# EAGLE design Taschenlampe_LX V1.0 (EAGLE 7.1.0)
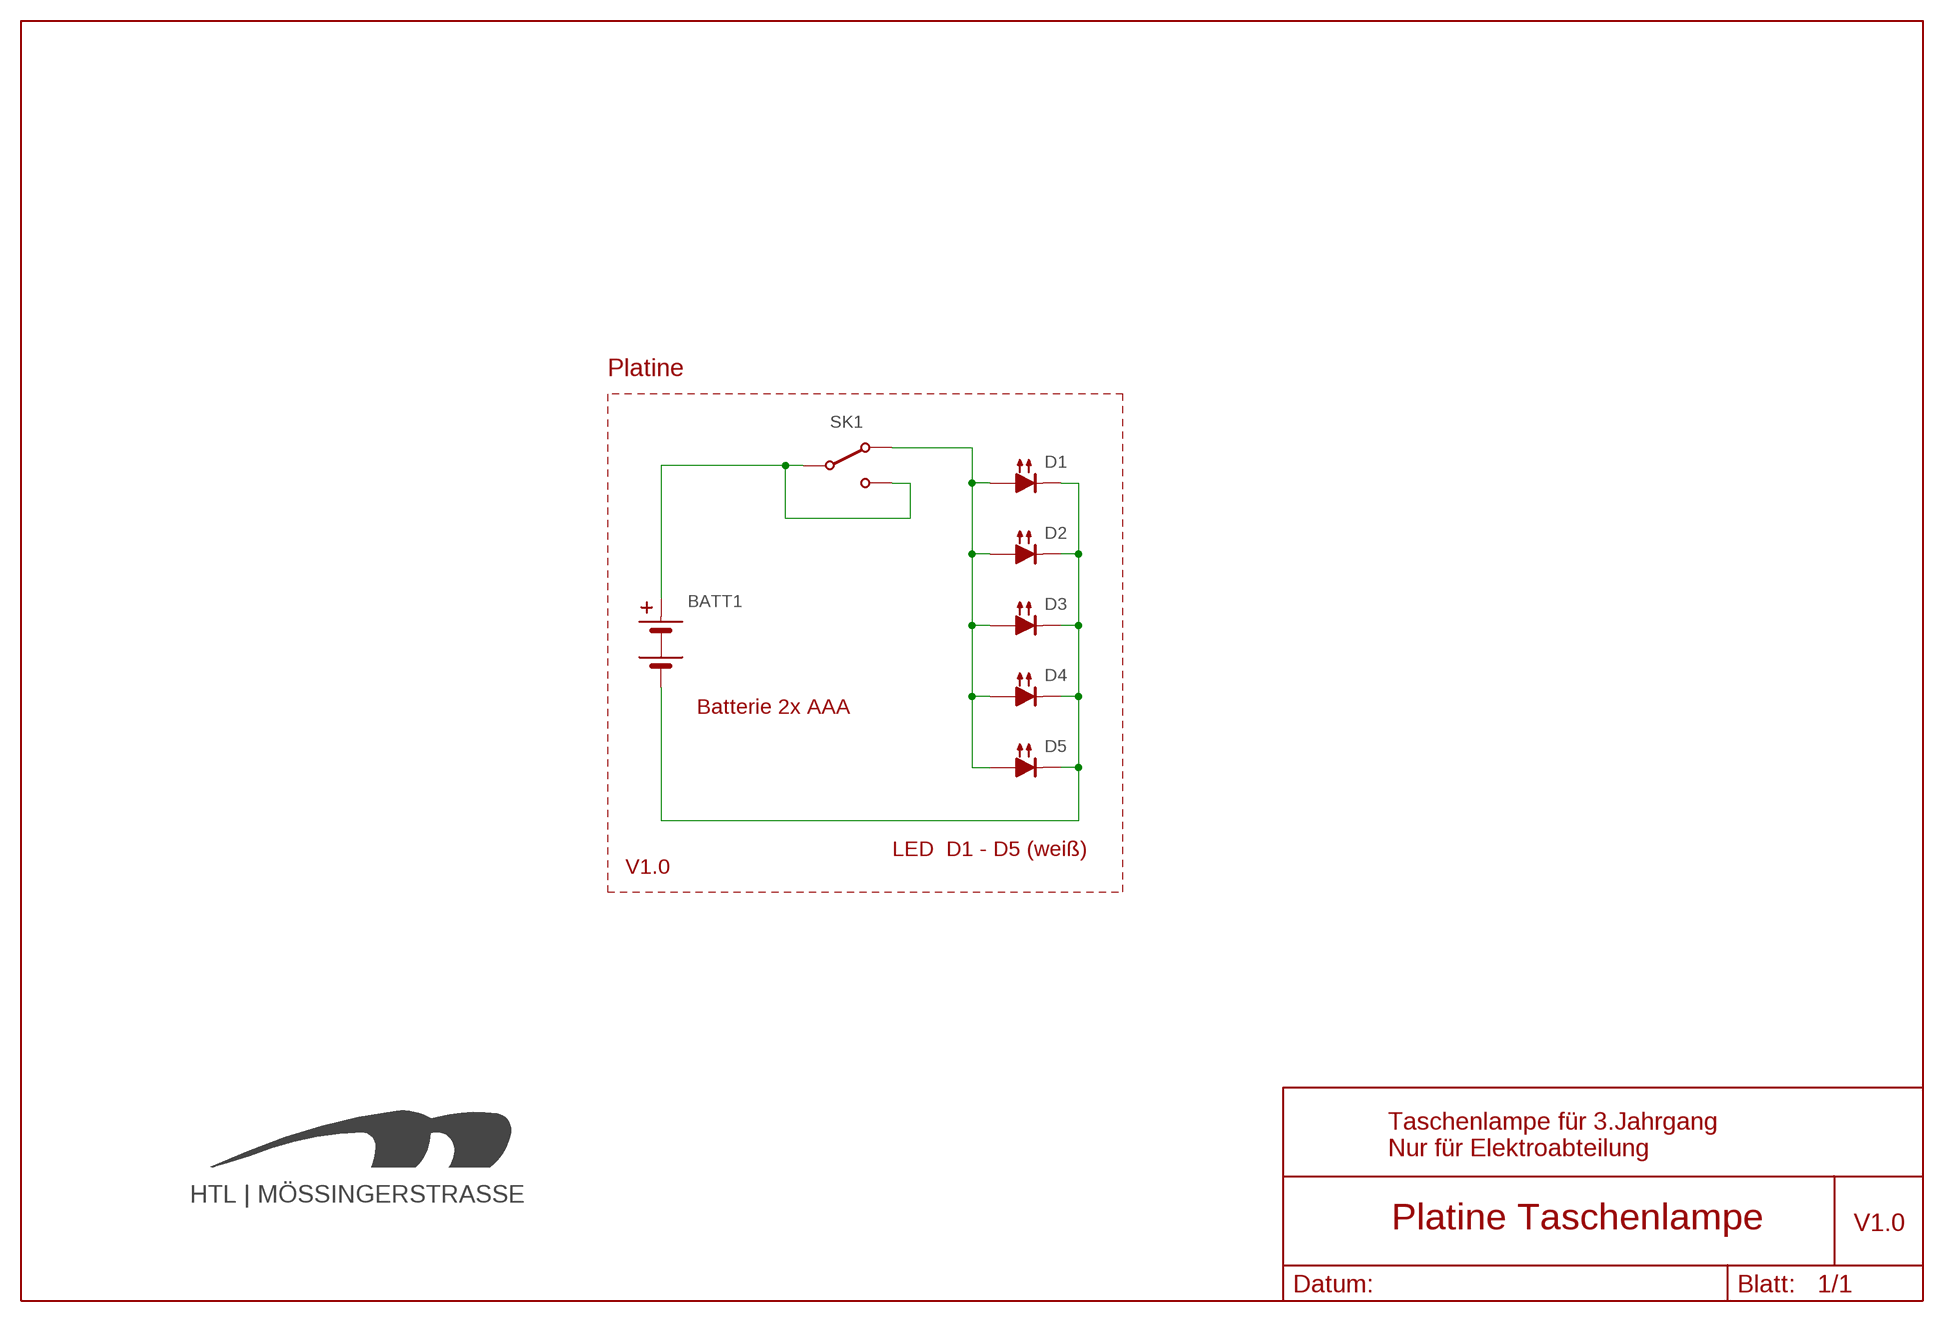
[diagram p0: schematic, sheet 1]

## Parts
BATT1  BATTERIEHALTER_2X_AAA  [BATTERIEHALTER]
D1  LEUCHTDIODE_DIN_ALT  [LEUCHTDIODE]
D2  LEUCHTDIODE_DIN_ALT  [LEUCHTDIODE]
D3  LEUCHTDIODE_DIN_ALT  [LEUCHTDIODE]
D4  LEUCHTDIODE_DIN_ALT  [LEUCHTDIODE]
D5  LEUCHTDIODE_DIN_ALT  [LEUCHTDIODE]
SK1  SCHALTER  [SCHALTER]
U$2  HTL_LOGOBOT_15MM  [LOGOBOT_15]

## Nets
N$1: BATT1.P+ SK1.P SK1.P2
N$2: D1.A D2.A D3.A D4.A D5.A SK1.P1
N$3: BATT1.P- D1.K D2.K D3.K D4.K D5.K

## Notes on the sheet
- Platine
- Batterie 2x AAA
- LED  D1 - D5 (weiß)
- V1.0
- Taschenlampe für 3.Jahrgang 
  Nur für Elektroabteilung
- Platine Taschenlampe | V1.0

## Library data of the parts
BATT1 = Taschenlampe:BATTERIEHALTER_2X_AAA: Batteriehalter 2x AAA, printbar
D1-D5 = Taschenlampe:LEUCHTDIODE_DIN_ALT: Leuchtdiode DIN-Norm (alt)
SK1 = Taschenlampe:SCHALTER: Schiebeschalter, Wechsler
U$2 = HTL-Logo:HTL_LOGO

## Board
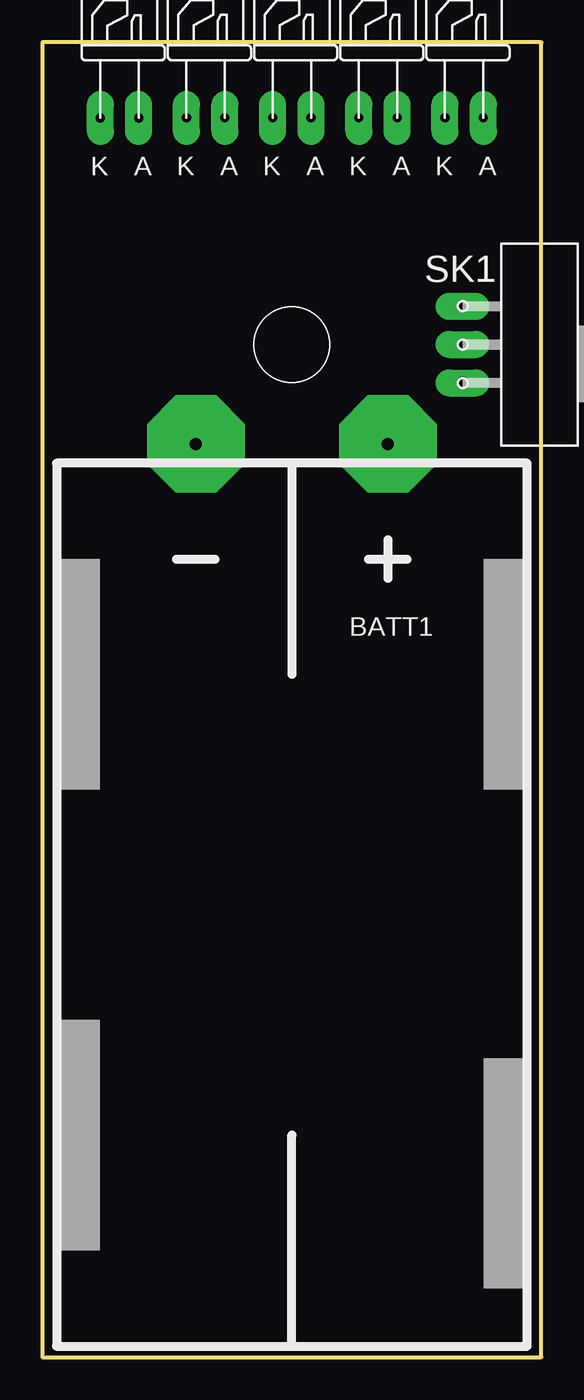
[diagram p1: board, top side]
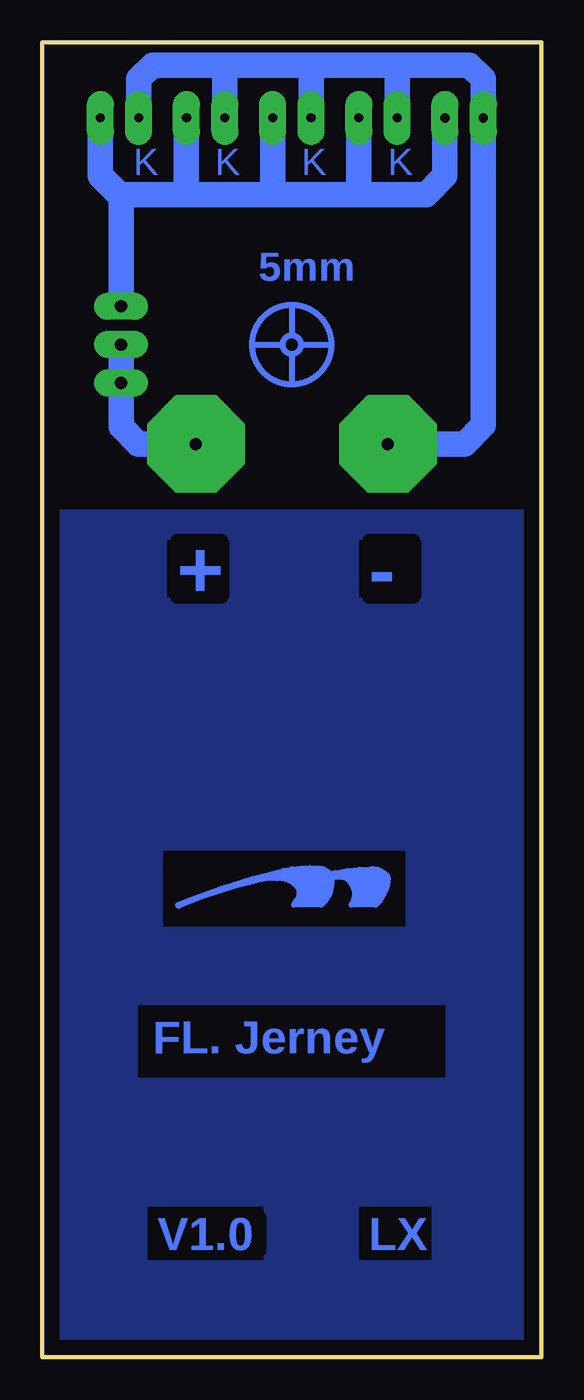
[diagram p2: board, bottom side, seen from below]

Size 33 x 87 mm. Coordinates in mm from the lower left corner, seen from the top.
Outline: 33,0 33,87 0,87 0,0 33,0
Copper layers (1*16): Top 0.035mm / dielectric 1.5mm / Bottom 0.035mm
Design rules "default": minimum track width 10mil, minimum drill 24mil, track to track 16mil, track to pad 16mil, pad to pad 15mil, via to via 16mil, smd to smd 8mil, copper to edge 40mil, drill to drill 8mil, minimum pad ring 10mil, minimum via ring 8mil, stop-mask expansion 4mil, vias tented up to drill 0mil, thermal gap 10mil
bRestrict: area 9,28.5 to 25,33.5; area 7.3,6.4 to 12.1,9.9; area 18.4,6.4 to 26,9.9; area 6.3,18.5 to 26.7,23.3; area 20.6,50.3 to 24.8,54.1; area 7.9,50.3 to 12.1,54.1

### Footprints (pad centres in the part's own frame; a part is rotated, then mirrored left to right if it is on the bottom)
BATTERIEHALTER = drill 0.813 pad 6.452 octagon: P+ 6.35,30.48; P- -6.35,30.48
LEUCHTDIODE = drill 0.61 pad 1.778 long: A 1.27,0; K -1.27,0
SCHALTER = drill 0.813 pad 1.778 long: P 0,0; P1 0,2.54; P2 0,-2.54

### Placement (x,y rotation side)
BATT1  16.5,29.94 0 top
D1  27.9,82.01 0 top
D2  22.2,82.01 0 top
D3  16.5,82.01 0 top
D4  10.8,82.01 0 top
D5  5.1,82 0 top
LOGO  [LOGOBOT_15]  15.23,29.94 0 top
SK1  27.8,67 0 top
U$2  15.23,29.94 0 top

### Tracks (layer width: path | path; a pad name or v marks a point on that pad's centre or on a via)
N$1
  Bottom 1.676: BATT1.P+ 26.66,60.42 27.8,61.56 SK1.P2 SK1.P
N$2
  Bottom 1.676: D1.A 29.17,78.17 27.93,76.93 | 27.93,76.93 23.48,76.93 | 23.48,76.93 17.77,76.93 | 17.77,76.93 12.05,76.93 | 12.05,76.93 7.61,76.93 6.37,78.17 D5.A | D4.A 12.07,76.94 12.05,76.93 | D3.A 17.77,76.93 | D2.A 23.47,76.94 23.48,76.93 | SK1.P1 27.8,76.8 27.93,76.93
N$3
  Bottom 1.676: BATT1.P- 5.07,60.42 3.83,61.66 D5.K 3.83,84.58 4.75,85.5 9.52,85.5 | D1.K 26.63,84.58 25.71,85.5 21.26,85.5 | 9.52,85.5 14.91,85.5 | 14.91,85.5 21.26,85.5 | D4.K 9.53,85.49 9.52,85.5 | D3.K 15.23,85.19 14.91,85.5 | D2.K 20.93,85.17 21.26,85.5
S$3
  Bottom 1.676: 3.8,82.03 3.83,82 3.8,81.97
S$4
  pour Bottom: 0,0 33,0 33,56 0,56
S$5
  Bottom 0.406: 16.5,69.6 16.5,67.6
S$6
  Bottom 0.406: 19.1,67 17.1,67
S$7
  Bottom 0.406: 15.9,67 13.9,67
S$8
  Bottom 0.406: 16.5,66.4 16.5,64.4
S$9
  Bottom 0.305: 0,0 33,0 33,87 0,87 0,0
(copper drawn outside any net)
  shapes: Bottom circle x2

### Text on the board
Bottom: K | K | K | K | 5mm | - | + | FL. Jerney | LX | V1.0